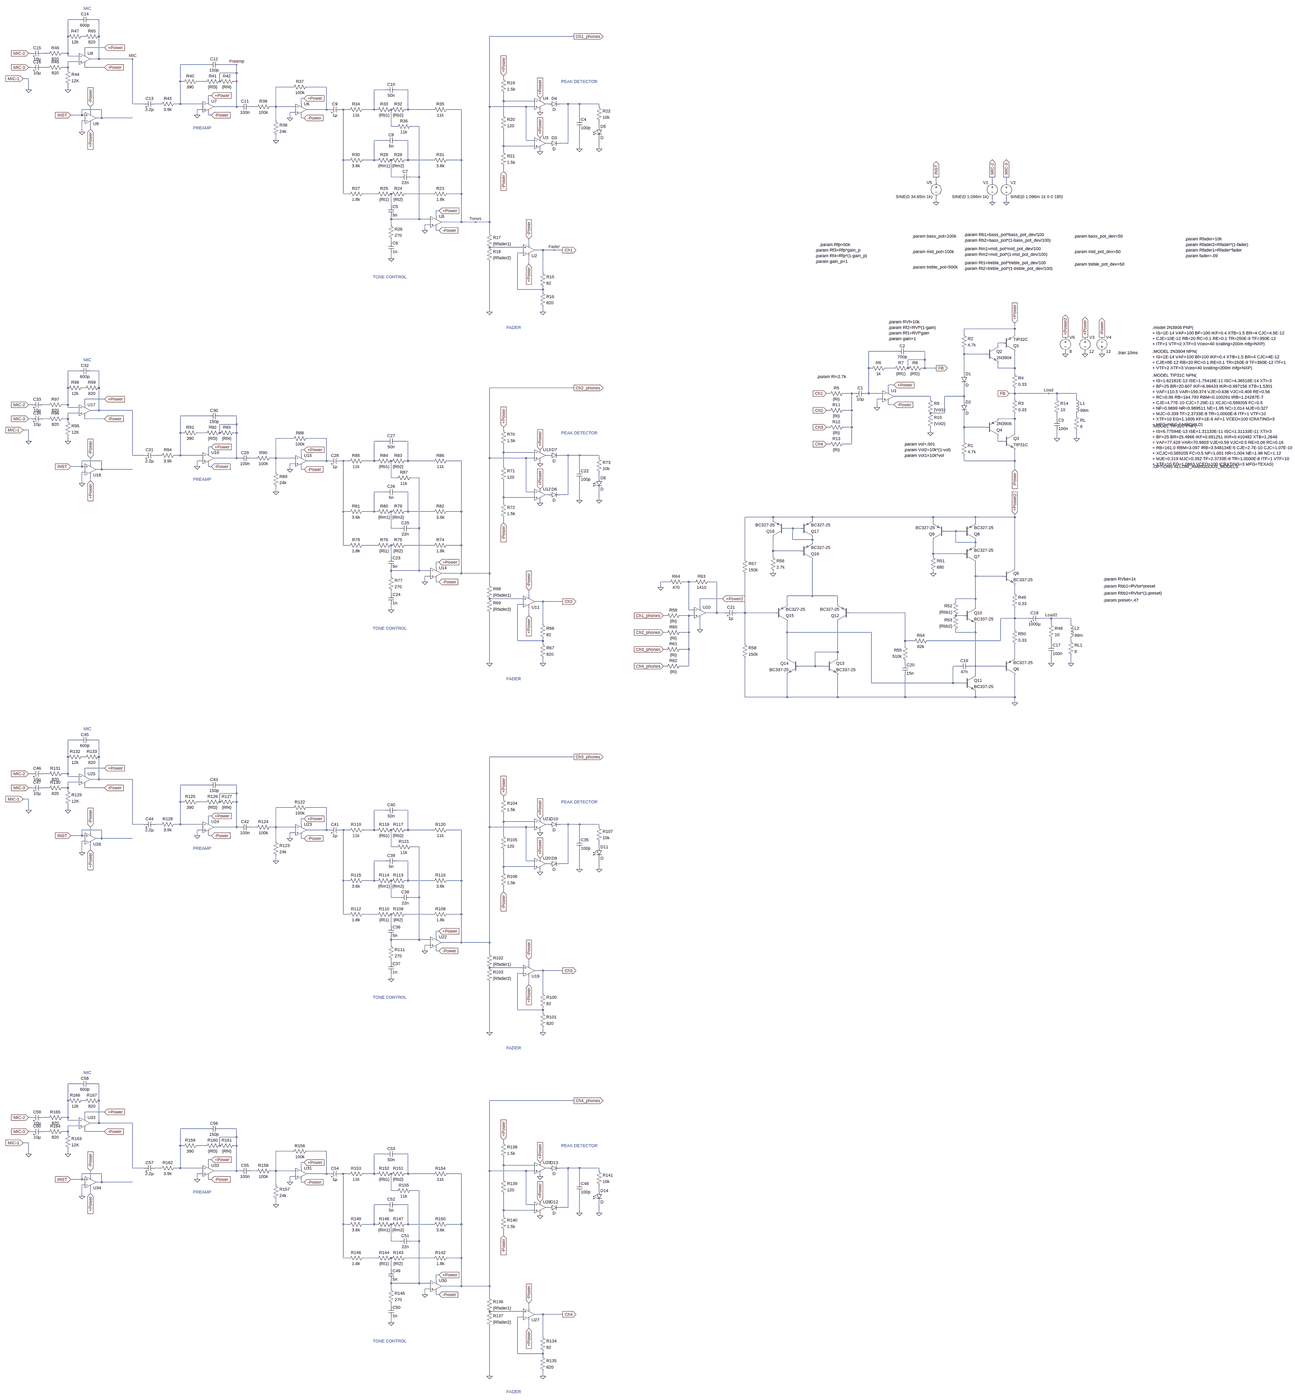
[diagram p0: schematic Project with Zobel.asc, whole sheet]
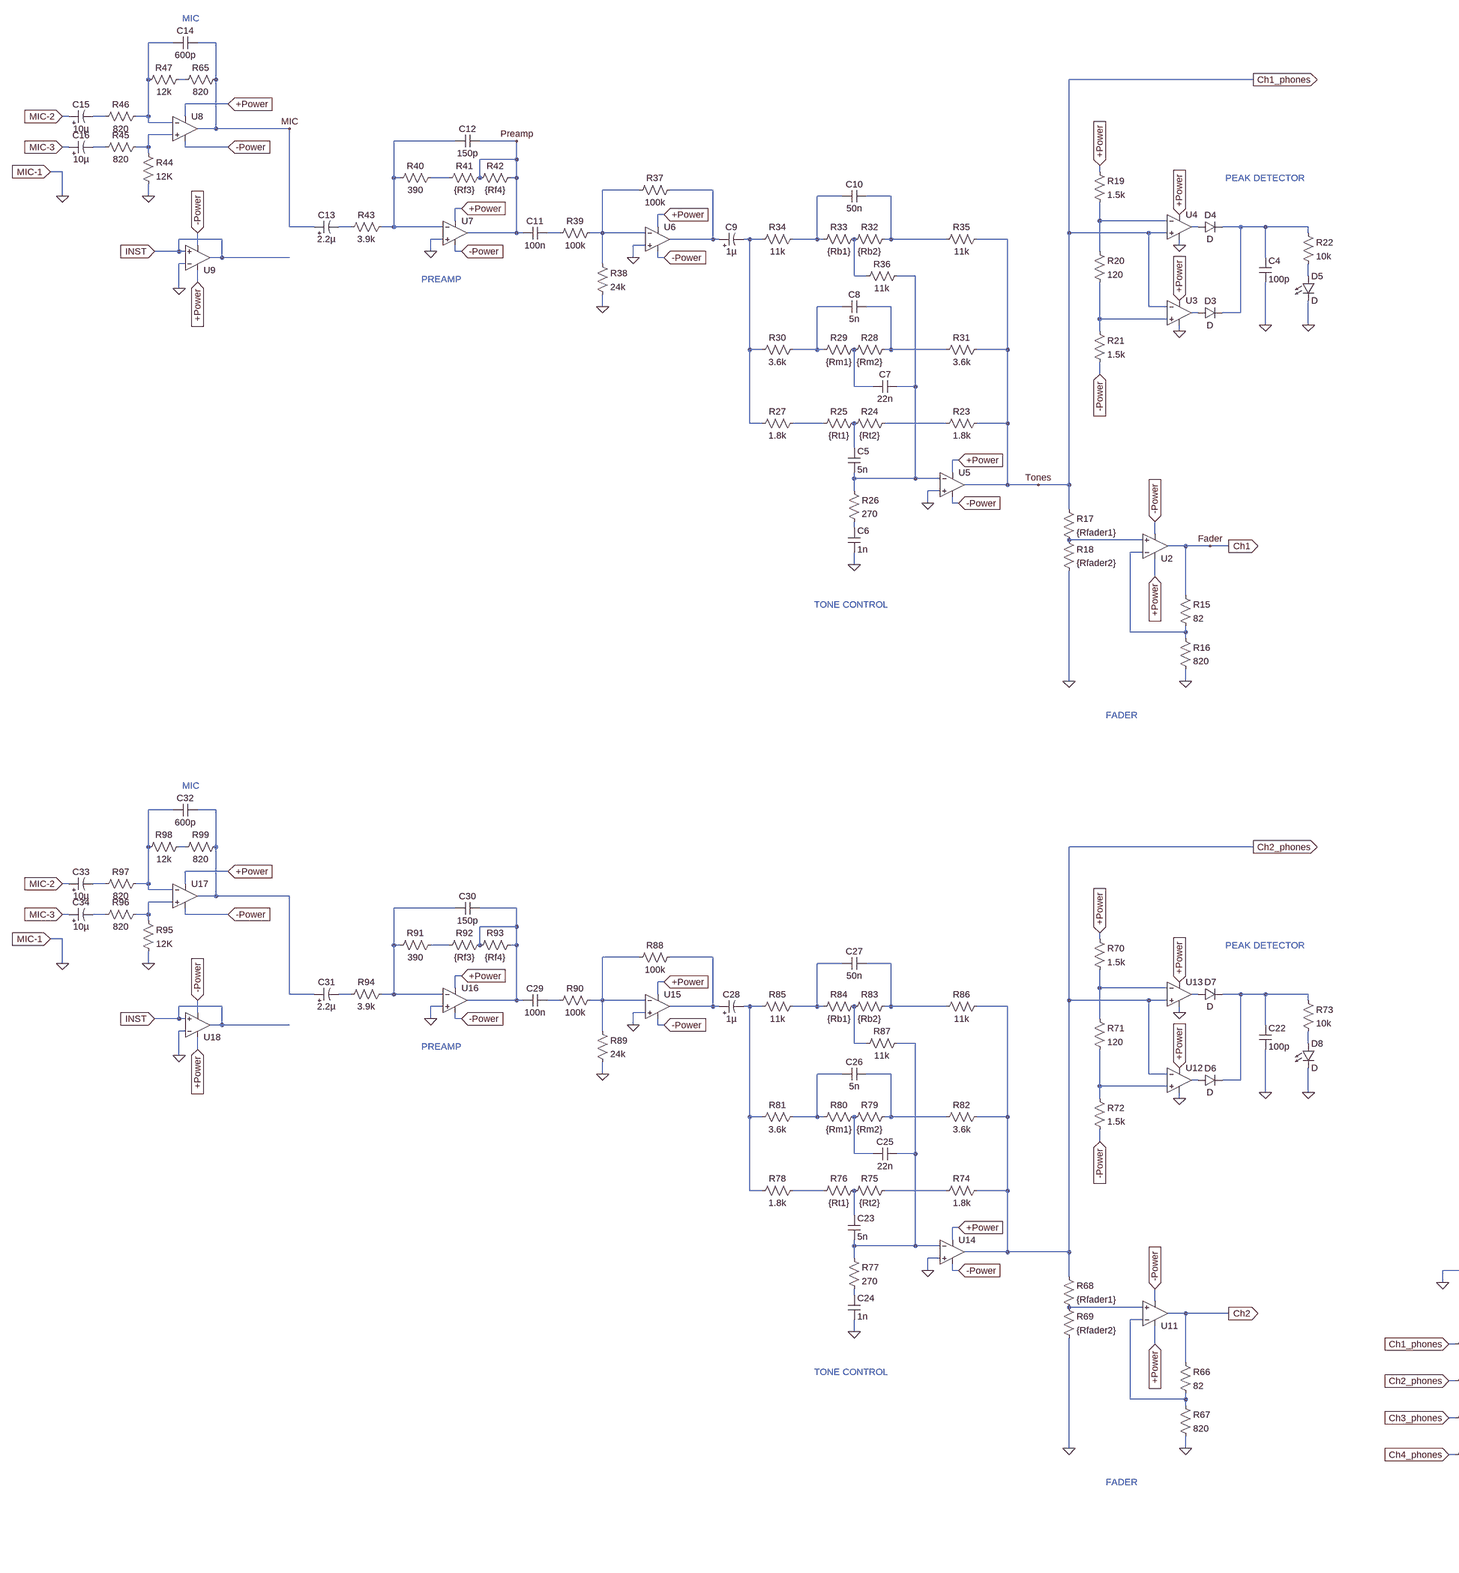
[diagram p1: schematic Project with Zobel.asc, part, row 1 of 2, column 1 of 2]
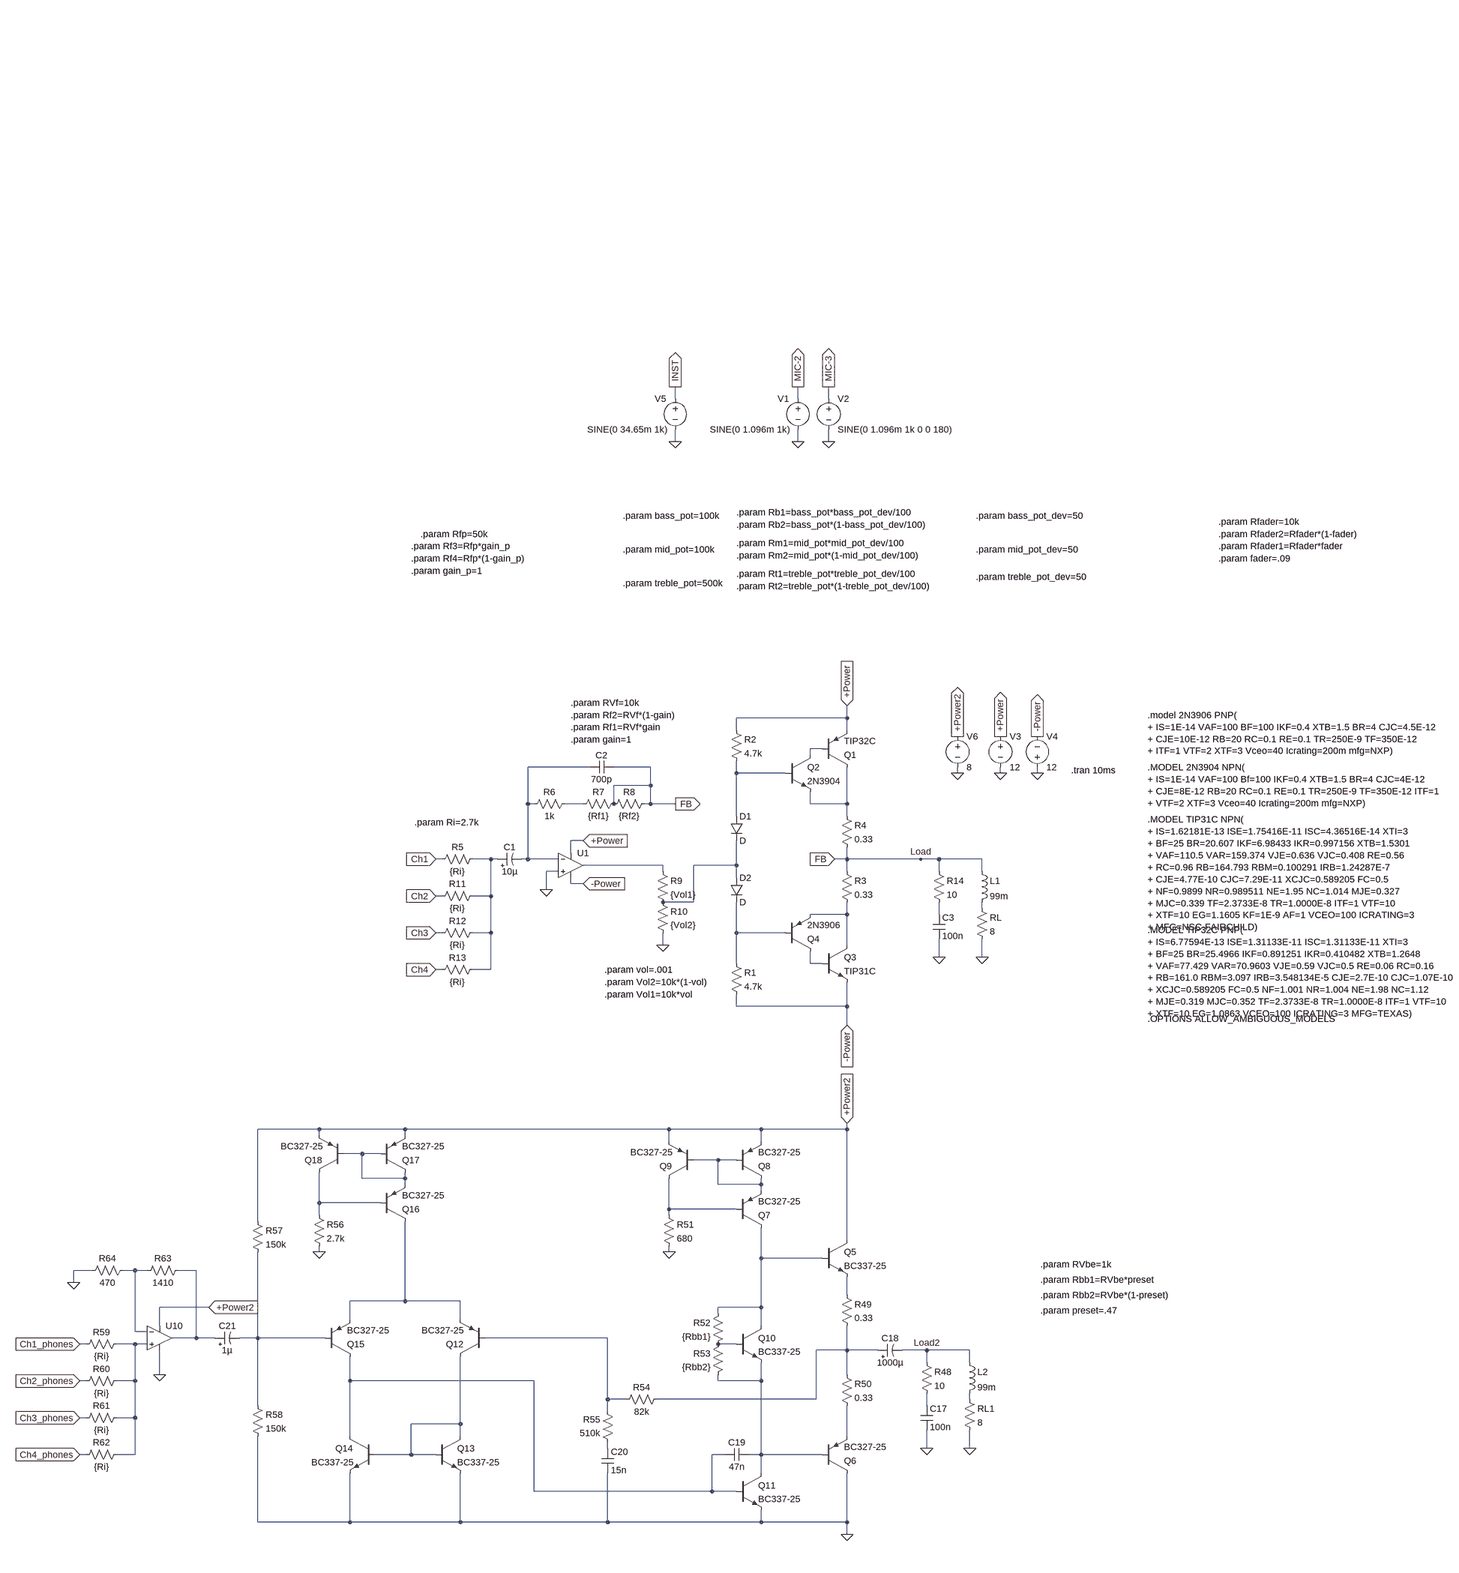
[diagram p2: schematic Project with Zobel.asc, part, row 1 of 2, column 2 of 2]
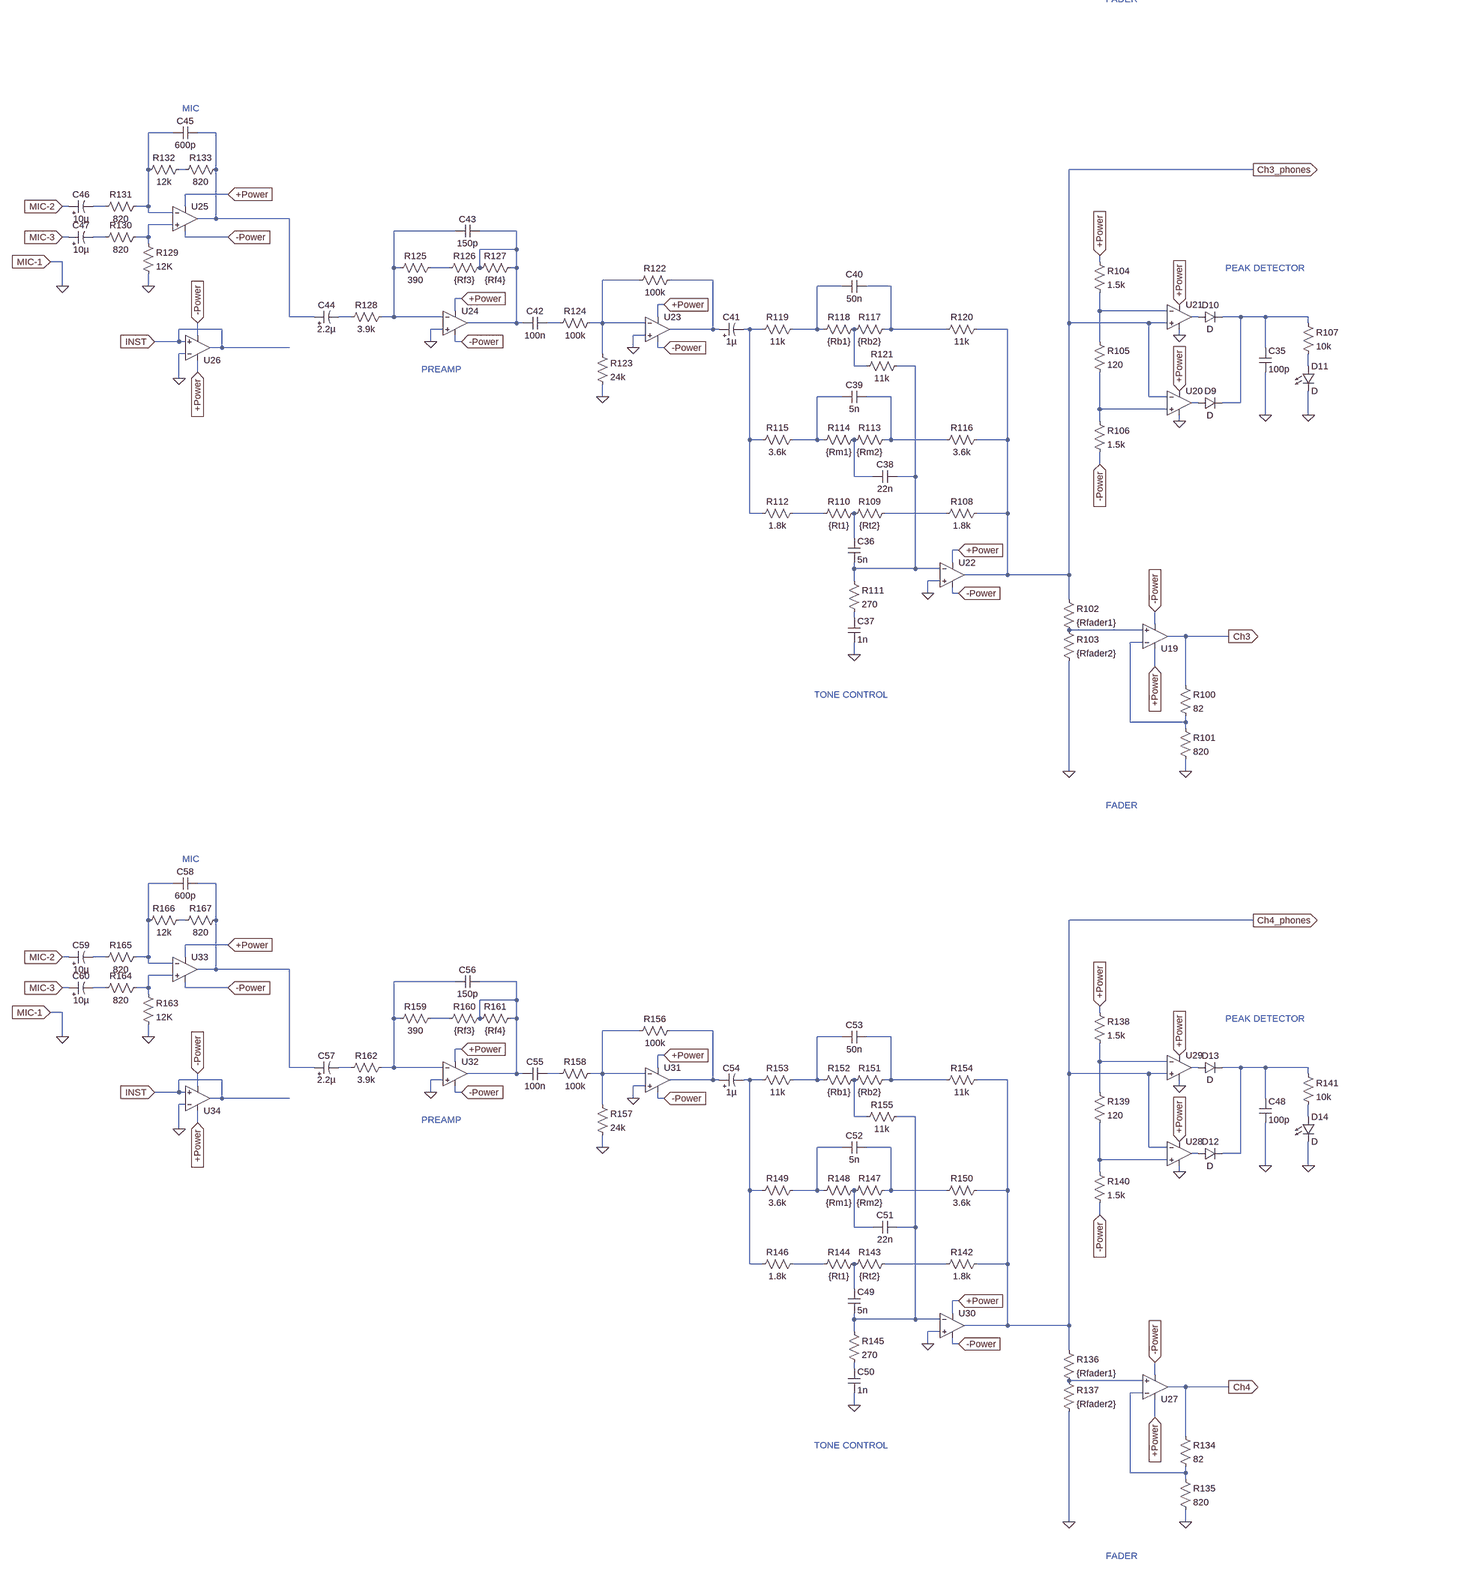
[diagram p3: schematic Project with Zobel.asc, part, row 2 of 2, column 1 of 2]
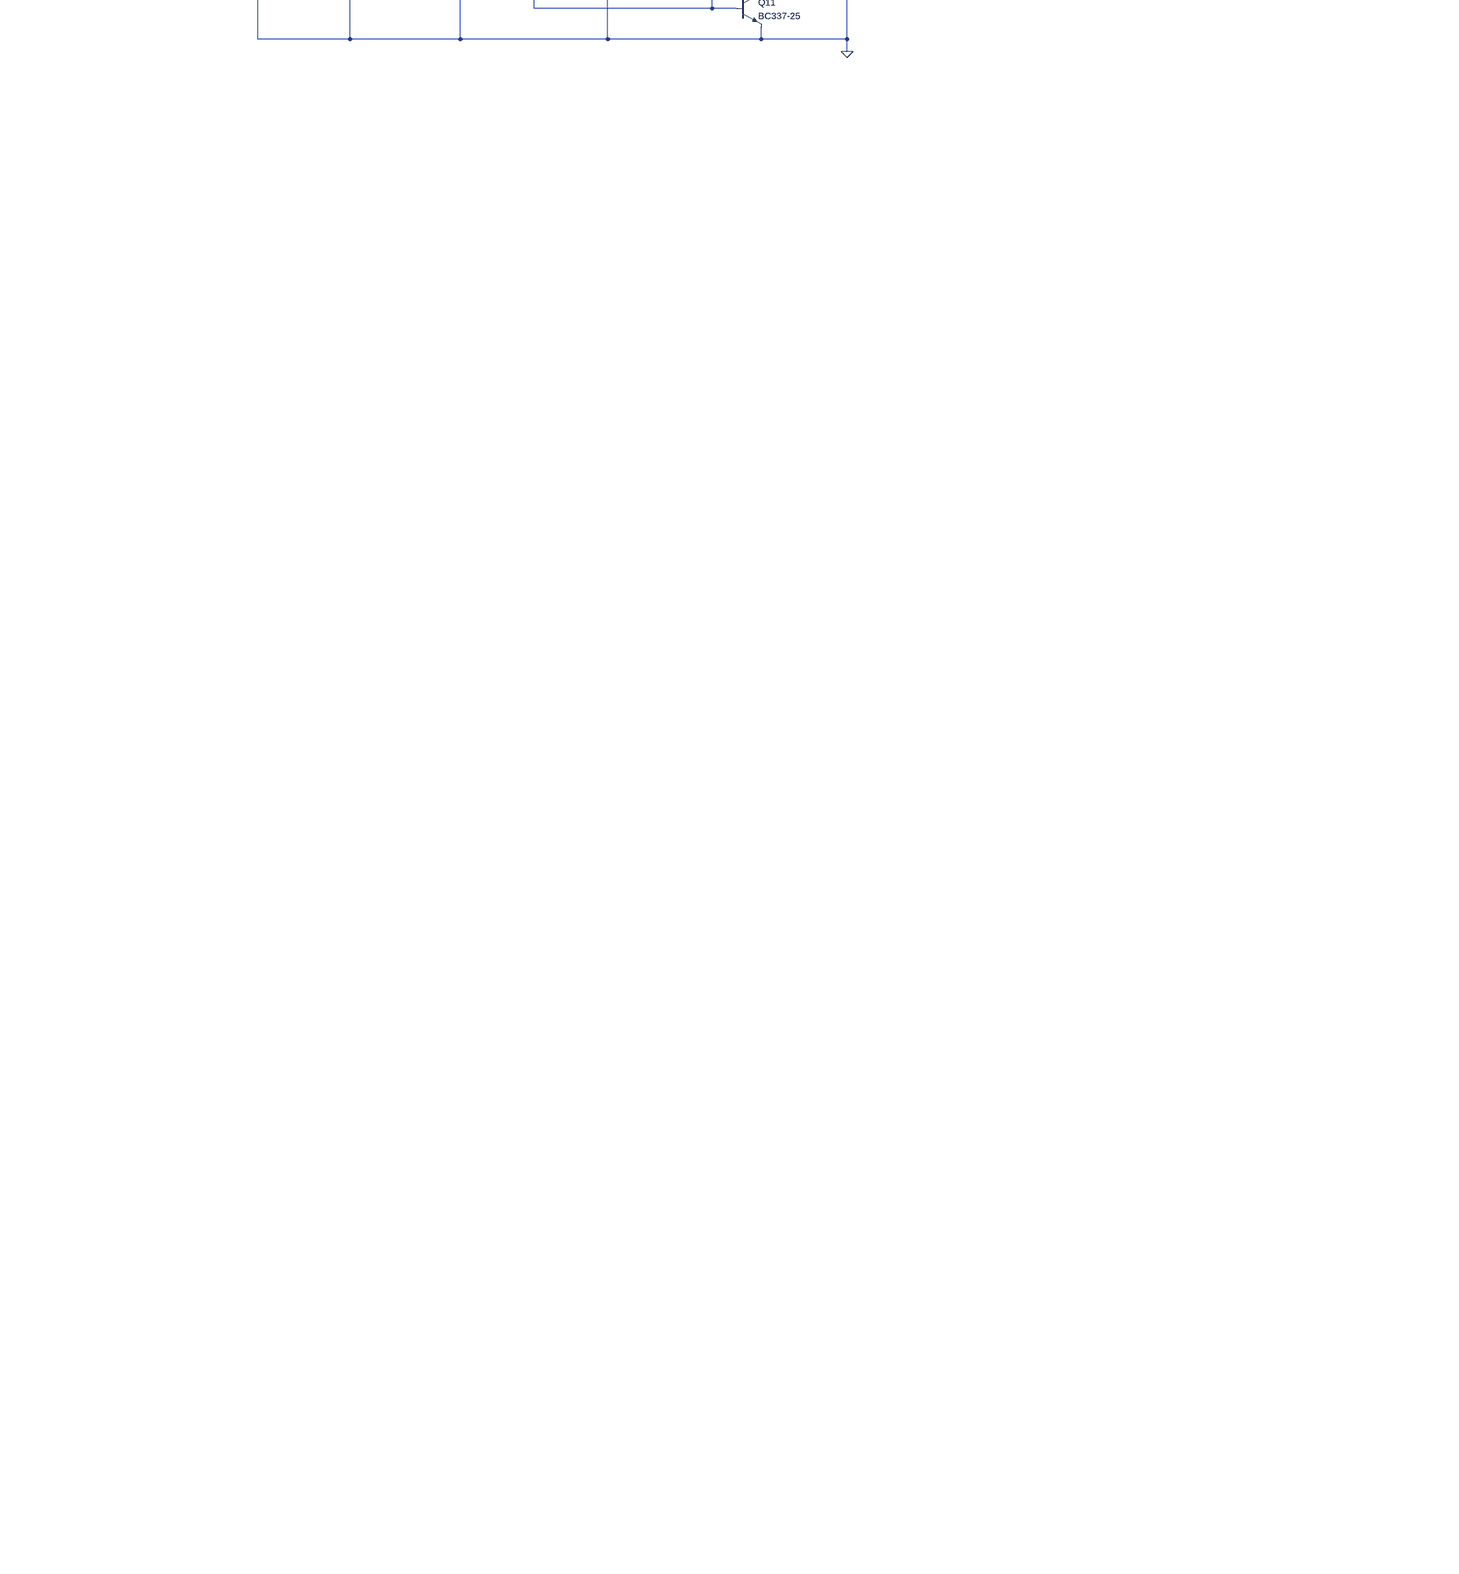
[diagram p4: schematic Project with Zobel.asc, part, row 2 of 2, column 2 of 2]
* Project with Zobel.asc
V3 +Power 0 12
V4 0 -Power 12
Q2 N032 N034 N036 0 2N3904
Q3 N049 N057 -Power 0 TIP31C
Q4 N057 N051 N049 0 2N3906
D1 N034 N042 D
D2 N042 N051 D
R2 +Power N034 4.7k
RL N047 0 8
R1 N051 -Power 4.7k
R3 Load N049 0.33
R4 N036 Load 0.33
Q1 N036 N032 +Power 0 TIP32C
X§U1 0 N033 +Power -Power N041 level1 Avol=1Meg GBW=10Meg Vos=0 En=0 Enk=0 In=0 Ink=0 Rin=500Meg  ; pins In+ In- V+ V- OUT
R5 N040 Fader {Ri}
R6 N035 N033 1k
R7 Load N035 {Rf1}
R8 Load Load {Rf2}
R9 N041 N042 {Vol1}
R10 N042 0 {Vol2}
R11 N040 Ch2 {Ri}
R12 N040 Ch3 {Ri}
R13 N040 Ch4 {Ri}
C1 N040 N033 10µ
C2 Load N033 700p
L1 Load N047 99m
R14 Load N050 10
C3 N050 0 100n
X§U2 N030 N031 +Power -Power Fader level1 Avol=1Meg GBW=10Meg Vos=0 En=0 Enk=0 In=0 Ink=0 Rin=500Meg  ; pins In+ In- V+ V- OUT
R15 Fader N031 82
R16 N031 0 820
R17 Tones N030 {Rfader1}
R18 N030 0 {Rfader2}
X§U3 N024 Tones +Power 0 N023 level1 Avol=1Meg GBW=10Meg Vos=0 En=0 Enk=0 In=0 Ink=0 Rin=500Meg  ; pins In+ In- V+ V- OUT
D3 N023 N015 D
X§U4 Tones N012 +Power 0 N014 level1 Avol=1Meg GBW=10Meg Vos=0 En=0 Enk=0 In=0 Ink=0 Rin=500Meg  ; pins In+ In- V+ V- OUT
D4 N014 N015 D
R19 +Power N012 1.5k
R20 N012 N024 120
R21 N024 -Power 1.5k
R22 N015 N020 10k
D5 N020 0 D
X§U5 0 N019 +Power -Power Tones level1 Avol=1Meg GBW=10Meg Vos=0 En=0 Enk=0 In=0 Ink=0 Rin=500Meg  ; pins In+ In- V+ V- OUT
R23 Tones N027 1.8k
R24 N027 N028 {Rt2}
R25 N028 N026 {Rt1}
C5 N028 N019 5n
R26 N019 N029 270
C6 N029 0 1n
R27 N026 N017 1.8k
C7 N019 N025 22n
R28 N022 N025 {Rm2}
R29 N025 N021 {Rm1}
C8 N022 N021 5n
R30 N021 N017 3.6k
R31 Tones N022 3.6k
R32 N011 N018 {Rb2}
R33 N018 N010 {Rb1}
C10 N011 N010 50n
R34 N010 N017 11k
R35 Tones N011 11k
R36 N019 N018 11k
C9 N009 N017 1µ
X§U6 0 N008 +Power -Power N009 level1 Avol=1Meg GBW=10Meg Vos=0 En=0 Enk=0 In=0 Ink=0 Rin=500Meg  ; pins In+ In- V+ V- OUT
R37 N009 N008 100k
R38 N008 0 24k
R39 N008 N016 100k
C11 N016 Preamp 100n
X§U7 0 N005 +Power -Power Preamp level1 Avol=1Meg GBW=10Meg Vos=0 En=0 Enk=0 In=0 Ink=0 Rin=500Meg  ; pins In+ In- V+ V- OUT
R40 N007 N005 390
R41 Preamp N007 {Rf3}
R42 Preamp Preamp {Rf4}
C12 Preamp N005 150p
R43 N005 N013 3.9k
C13 MIC N013 2.2µ
X§U8 N004 N001 +Power -Power MIC level1 Avol=1Meg GBW=10Meg Vos=0 En=0 Enk=0 In=0 Ink=0 Rin=500Meg  ; pins In+ In- V+ V- OUT
R44 N004 0 12K
R45 N004 N006 820
R46 N001 N003 820
C14 MIC N001 600p
C15 MIC-2 N003 10µ
C16 MIC-3 N006 10µ
V1 MIC-2 0 SINE(0 1.096m 1k)
V2 MIC-3 0 SINE(0 1.096m 1k 0 0 180)
X§U9 INST 0 +Power -Power INST level1 Avol=1Meg GBW=10Meg Vos=0 En=0 Enk=0 In=0 Ink=0 Rin=500Meg  ; pins In+ In- V+ V- OUT
V5 INST 0 SINE(0 34.65m 1k)
RL1 N094 0 8
L2 Load2 N094 99m
R48 Load2 N095 10
C17 N095 0 100n
C18 N091 Load2 1000µ
R49 N083 N091 0.33
R50 N091 N097 0.33
Q5 +Power2 N079 N083 0 BC337-25
Q6 0 N093 N097 0 BC327-25
Q7 N079 N077 N073 0 BC327-25
Q8 N073 N073 +Power2 0 BC327-25
Q9 N077 N073 +Power2 0 BC327-25
R51 N077 0 680
Q10 N079 N090 N093 0 BC337-25
R52 N079 N090 {Rbb1}
R53 N090 N093 {Rbb2}
Q11 N093 N092 0 0 BC337-25
C19 N093 N092 47n
R54 N091 N088 82k
R55 N098 N088 510k
C20 N098 0 15n
Q12 N096 N088 N084 0 BC327-25
Q13 N096 N096 0 0 BC337-25
Q14 N092 N096 0 0 BC337-25
Q15 N092 N087 N084 0 BC327-25
Q16 N084 N076 N072 0 BC327-25
Q17 N072 N072 +Power2 0 BC327-25
Q18 N076 N072 +Power2 0 BC327-25
R56 N076 0 2.7k
R57 +Power2 N087 150k
R58 N087 0 150k
X§U10 N089 N080 +Power2 0 N081 level1 Avol=1Meg GBW=10Meg Vos=0 En=0 Enk=0 In=0 Ink=0 Rin=500Meg  ; pins In+ In- V+ V- OUT
R59 N089 Tones {Ri}
R60 N089 Ch2_phones {Ri}
R61 N089 Ch3_phones {Ri}
R62 N089 Ch4_phones {Ri}
C21 N081 N087 1µ
R63 N081 N080 1410
R64 N080 0 470
R47 N002 N001 12k
R65 MIC N002 820
X§U11 N085 N086 +Power -Power Ch2 level1 Avol=1Meg GBW=10Meg Vos=0 En=0 Enk=0 In=0 Ink=0 Rin=500Meg  ; pins In+ In- V+ V- OUT
R66 Ch2 N086 82
R67 N086 0 820
R68 Ch2_phones N085 {Rfader1}
R69 N085 0 {Rfader2}
X§U12 N070 Ch2_phones +Power 0 N069 level1 Avol=1Meg GBW=10Meg Vos=0 En=0 Enk=0 In=0 Ink=0 Rin=500Meg  ; pins In+ In- V+ V- OUT
D6 N069 N061 D
X§U13 Ch2_phones N058 +Power 0 N060 level1 Avol=1Meg GBW=10Meg Vos=0 En=0 Enk=0 In=0 Ink=0 Rin=500Meg  ; pins In+ In- V+ V- OUT
D7 N060 N061 D
R70 +Power N058 1.5k
R71 N058 N070 120
R72 N070 -Power 1.5k
R73 N061 N066 10k
D8 N066 0 D
X§U14 0 N065 +Power -Power Ch2_phones level1 Avol=1Meg GBW=10Meg Vos=0 En=0 Enk=0 In=0 Ink=0 Rin=500Meg  ; pins In+ In- V+ V- OUT
R74 Ch2_phones N075 1.8k
R75 N075 N078 {Rt2}
R76 N078 N074 {Rt1}
C23 N078 N065 5n
R77 N065 N082 270
C24 N082 0 1n
R78 N074 N063 1.8k
C25 N065 N071 22n
R79 N068 N071 {Rm2}
R80 N071 N067 {Rm1}
C26 N068 N067 5n
R81 N067 N063 3.6k
R82 Ch2_phones N068 3.6k
R83 N056 N064 {Rb2}
R84 N064 N055 {Rb1}
C27 N056 N055 50n
R85 N055 N063 11k
R86 Ch2_phones N056 11k
R87 N065 N064 11k
C28 N054 N063 1µ
X§U15 0 N053 +Power -Power N054 level1 Avol=1Meg GBW=10Meg Vos=0 En=0 Enk=0 In=0 Ink=0 Rin=500Meg  ; pins In+ In- V+ V- OUT
R88 N054 N053 100k
R89 N053 0 24k
R90 N053 N062 100k
C29 N062 N046 100n
X§U16 0 N045 +Power -Power N046 level1 Avol=1Meg GBW=10Meg Vos=0 En=0 Enk=0 In=0 Ink=0 Rin=500Meg  ; pins In+ In- V+ V- OUT
R91 N052 N045 390
R92 N046 N052 {Rf3}
R93 N046 N046 {Rf4}
C30 N046 N045 150p
R94 N045 N059 3.9k
C31 N038 N059 2.2µ
X§U17 N044 N037 +Power -Power N038 level1 Avol=1Meg GBW=10Meg Vos=0 En=0 Enk=0 In=0 Ink=0 Rin=500Meg  ; pins In+ In- V+ V- OUT
R95 N044 0 12K
R96 N044 N048 820
R97 N037 N043 820
C32 N038 N037 600p
C33 MIC-2 N043 10µ
C34 MIC-3 N048 10µ
X§U18 INST 0 +Power -Power INST level1 Avol=1Meg GBW=10Meg Vos=0 En=0 Enk=0 In=0 Ink=0 Rin=500Meg  ; pins In+ In- V+ V- OUT
R98 N039 N037 12k
R99 N038 N039 820
X§U19 N130 N131 +Power -Power Ch3 level1 Avol=1Meg GBW=10Meg Vos=0 En=0 Enk=0 In=0 Ink=0 Rin=500Meg  ; pins In+ In- V+ V- OUT
R100 Ch3 N131 82
R101 N131 0 820
R102 Ch3_phones N130 {Rfader1}
R103 N130 0 {Rfader2}
X§U20 N124 Ch3_phones +Power 0 N123 level1 Avol=1Meg GBW=10Meg Vos=0 En=0 Enk=0 In=0 Ink=0 Rin=500Meg  ; pins In+ In- V+ V- OUT
D9 N123 N115 D
X§U21 Ch3_phones N112 +Power 0 N114 level1 Avol=1Meg GBW=10Meg Vos=0 En=0 Enk=0 In=0 Ink=0 Rin=500Meg  ; pins In+ In- V+ V- OUT
D10 N114 N115 D
R104 +Power N112 1.5k
R105 N112 N124 120
R106 N124 -Power 1.5k
R107 N115 N120 10k
D11 N120 0 D
X§U22 0 N119 +Power -Power Ch3_phones level1 Avol=1Meg GBW=10Meg Vos=0 En=0 Enk=0 In=0 Ink=0 Rin=500Meg  ; pins In+ In- V+ V- OUT
R108 Ch3_phones N127 1.8k
R109 N127 N128 {Rt2}
R110 N128 N126 {Rt1}
C36 N128 N119 5n
R111 N119 N129 270
C37 N129 0 1n
R112 N126 N117 1.8k
C38 N119 N125 22n
R113 N122 N125 {Rm2}
R114 N125 N121 {Rm1}
C39 N122 N121 5n
R115 N121 N117 3.6k
R116 Ch3_phones N122 3.6k
R117 N111 N118 {Rb2}
R118 N118 N110 {Rb1}
C40 N111 N110 50n
R119 N110 N117 11k
R120 Ch3_phones N111 11k
R121 N119 N118 11k
C41 N109 N117 1µ
X§U23 0 N108 +Power -Power N109 level1 Avol=1Meg GBW=10Meg Vos=0 En=0 Enk=0 In=0 Ink=0 Rin=500Meg  ; pins In+ In- V+ V- OUT
R122 N109 N108 100k
R123 N108 0 24k
R124 N108 N116 100k
C42 N116 N105 100n
X§U24 0 N104 +Power -Power N105 level1 Avol=1Meg GBW=10Meg Vos=0 En=0 Enk=0 In=0 Ink=0 Rin=500Meg  ; pins In+ In- V+ V- OUT
R125 N107 N104 390
R126 N105 N107 {Rf3}
R127 N105 N105 {Rf4}
C43 N105 N104 150p
R128 N104 N113 3.9k
C44 N100 N113 2.2µ
X§U25 N103 N099 +Power -Power N100 level1 Avol=1Meg GBW=10Meg Vos=0 En=0 Enk=0 In=0 Ink=0 Rin=500Meg  ; pins In+ In- V+ V- OUT
R129 N103 0 12K
R130 N103 N106 820
R131 N099 N102 820
C45 N100 N099 600p
C46 MIC-2 N102 10µ
C47 MIC-3 N106 10µ
X§U26 INST 0 +Power -Power INST level1 Avol=1Meg GBW=10Meg Vos=0 En=0 Enk=0 In=0 Ink=0 Rin=500Meg  ; pins In+ In- V+ V- OUT
R132 N101 N099 12k
R133 N100 N101 820
X§U27 N163 N164 +Power -Power Ch4 level1 Avol=1Meg GBW=10Meg Vos=0 En=0 Enk=0 In=0 Ink=0 Rin=500Meg  ; pins In+ In- V+ V- OUT
R134 Ch4 N164 82
R135 N164 0 820
R136 Ch4_phones N163 {Rfader1}
R137 N163 0 {Rfader2}
X§U28 N157 Ch4_phones +Power 0 N156 level1 Avol=1Meg GBW=10Meg Vos=0 En=0 Enk=0 In=0 Ink=0 Rin=500Meg  ; pins In+ In- V+ V- OUT
D12 N156 N148 D
X§U29 Ch4_phones N145 +Power 0 N147 level1 Avol=1Meg GBW=10Meg Vos=0 En=0 Enk=0 In=0 Ink=0 Rin=500Meg  ; pins In+ In- V+ V- OUT
D13 N147 N148 D
R138 +Power N145 1.5k
R139 N145 N157 120
R140 N157 -Power 1.5k
R141 N148 N153 10k
D14 N153 0 D
X§U30 0 N152 +Power -Power Ch4_phones level1 Avol=1Meg GBW=10Meg Vos=0 En=0 Enk=0 In=0 Ink=0 Rin=500Meg  ; pins In+ In- V+ V- OUT
R142 Ch4_phones N160 1.8k
R143 N160 N161 {Rt2}
R144 N161 N159 {Rt1}
C49 N161 N152 5n
R145 N152 N162 270
C50 N162 0 1n
R146 N159 N150 1.8k
C51 N152 N158 22n
R147 N155 N158 {Rm2}
R148 N158 N154 {Rm1}
C52 N155 N154 5n
R149 N154 N150 3.6k
R150 Ch4_phones N155 3.6k
R151 N144 N151 {Rb2}
R152 N151 N143 {Rb1}
C53 N144 N143 50n
R153 N143 N150 11k
R154 Ch4_phones N144 11k
R155 N152 N151 11k
C54 N142 N150 1µ
X§U31 0 N141 +Power -Power N142 level1 Avol=1Meg GBW=10Meg Vos=0 En=0 Enk=0 In=0 Ink=0 Rin=500Meg  ; pins In+ In- V+ V- OUT
R156 N142 N141 100k
R157 N141 0 24k
R158 N141 N149 100k
C55 N149 N138 100n
X§U32 0 N137 +Power -Power N138 level1 Avol=1Meg GBW=10Meg Vos=0 En=0 Enk=0 In=0 Ink=0 Rin=500Meg  ; pins In+ In- V+ V- OUT
R159 N140 N137 390
R160 N138 N140 {Rf3}
R161 N138 N138 {Rf4}
C56 N138 N137 150p
R162 N137 N146 3.9k
C57 N133 N146 2.2µ
X§U33 N136 N132 +Power -Power N133 level1 Avol=1Meg GBW=10Meg Vos=0 En=0 Enk=0 In=0 Ink=0 Rin=500Meg  ; pins In+ In- V+ V- OUT
R163 N136 0 12K
R164 N136 N139 820
R165 N132 N135 820
C58 N133 N132 600p
C59 MIC-2 N135 10µ
C60 MIC-3 N139 10µ
X§U34 INST 0 +Power -Power INST level1 Avol=1Meg GBW=10Meg Vos=0 En=0 Enk=0 In=0 Ink=0 Rin=500Meg  ; pins In+ In- V+ V- OUT
R166 N134 N132 12k
R167 N133 N134 820
C4 N015 0 100p
C22 N061 0 100p
C35 N115 0 100p
C48 N148 0 100p
V6 +Power2 0 8
.model D D
.lib standard.dio
.model NPN NPN
.model PNP PNP
.lib standard.bjt
.tran 10ms
.MODEL 2N3904 NPN(
+ IS=1E-14 VAF=100 Bf=100 IKF=0.4 XTB=1.5 BR=4 CJC=4E-12
+ CJE=8E-12 RB=20 RC=0.1 RE=0.1 TR=250E-9 TF=350E-12 ITF=1
+ VTF=2 XTF=3 Vceo=40 Icrating=200m mfg=NXP)
.MODEL TIP31C NPN(
+ IS=1.62181E-13 ISE=1.75416E-11 ISC=4.36516E-14 XTI=3
+ BF=25 BR=20.607 IKF=6.98433 IKR=0.997156 XTB=1.5301
+ VAF=110.5 VAR=159.374 VJE=0.636 VJC=0.408 RE=0.56
+ RC=0.96 RB=164.793 RBM=0.100291 IRB=1.24287E-7
+ CJE=4.77E-10 CJC=7.29E-11 XCJC=0.589205 FC=0.5
+ NF=0.9899 NR=0.989511 NE=1.95 NC=1.014 MJE=0.327
+ MJC=0.339 TF=2.3733E-8 TR=1.0000E-8 ITF=1 VTF=10
+ XTF=10 EG=1.1605 KF=1E-9 AF=1 VCEO=100 ICRATING=3
+ MFG=NSC-FAIRCHILD)
.model 2N3906 PNP(
+ IS=1E-14 VAF=100 BF=100 IKF=0.4 XTB=1.5 BR=4 CJC=4.5E-12
+ CJE=10E-12 RB=20 RC=0.1 RE=0.1 TR=250E-9 TF=350E-12
+ ITF=1 VTF=2 XTF=3 Vceo=40 Icrating=200m mfg=NXP)
.MODEL TIP32C PNP(
+ IS=6.77594E-13 ISE=1.31133E-11 ISC=1.31133E-11 XTI=3
+ BF=25 BR=25.4966 IKF=0.891251 IKR=0.410482 XTB=1.2648
+ VAF=77.429 VAR=70.9603 VJE=0.59 VJC=0.5 RE=0.06 RC=0.16
+ RB=161.0 RBM=3.097 IRB=3.548134E-5 CJE=2.7E-10 CJC=1.07E-10
+ XCJC=0.589205 FC=0.5 NF=1.001 NR=1.004 NE=1.98 NC=1.12
+ MJE=0.319 MJC=0.352 TF=2.3733E-8 TR=1.0000E-8 ITF=1 VTF=10
+ XTF=10 EG=1.0863 VCEO=100 ICRATING=3 MFG=TEXAS)
.param vol=.001
.param gain=1
.param Rf1=RVf*gain
.param Rf2=RVf*(1-gain)
.param Vol1=10k*vol
.param Vol2=10k*(1-vol)
.OPTIONS ALLOW_AMBIGUOUS_MODELS
.param RVf=10k
.param Ri=2.7k
.param fader=.09
.param Rfader1=Rfader*fader
.param Rfader2=Rfader*(1-fader)
.param Rfader=10k
.param Rb1=bass_pot*bass_pot_dev/100
.param Rb2=bass_pot*(1-bass_pot_dev/100)
.param Rm1=mid_pot*mid_pot_dev/100
.param Rm2=mid_pot*(1-mid_pot_dev/100)
.param Rt1=treble_pot*treble_pot_dev/100
.param Rt2=treble_pot*(1-treble_pot_dev/100)
.param bass_pot=100k
.param mid_pot=100k
.param treble_pot=500k
.param bass_pot_dev=50
.param mid_pot_dev=50
.param treble_pot_dev=50
.param Rfp=50k
.param Rf3=Rfp*gain_p
.param Rf4=Rfp*(1-gain_p)
.param gain_p=1
* MIC
* PREAMP
* TONE CONTROL
* FADER
* PEAK DETECTOR
.param RVbe=1k
.param Rbb1=RVbe*preset
.param Rbb2=RVbe*(1-preset)
.param preset=.47
* MIC
* PREAMP
* TONE CONTROL
* FADER
* PEAK DETECTOR
* MIC
* PREAMP
* TONE CONTROL
* FADER
* PEAK DETECTOR
* MIC
* PREAMP
* TONE CONTROL
* FADER
* PEAK DETECTOR
.lib UniversalOpAmp1.lib
.backanno
.end